# Altium project InterfaceBoard.PrjPcb
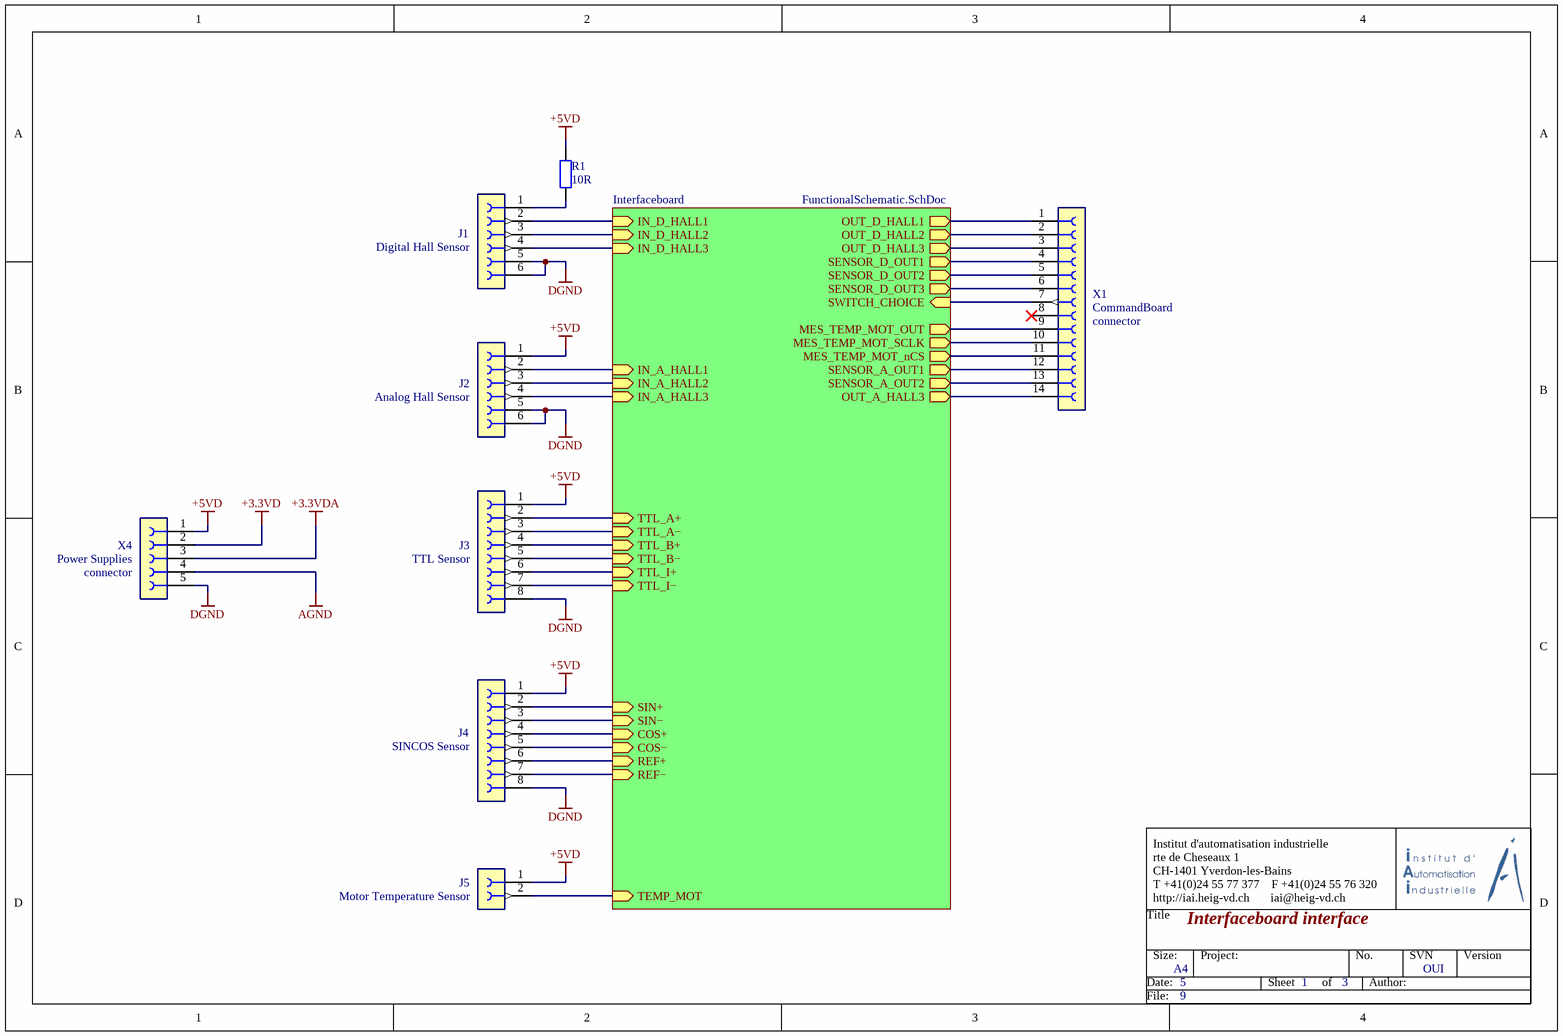
[diagram p0: InterfaceBoard.SchDoc]
ProjectAuthor: Bommottet Joan; ProjectiAiTitle: Driver Brushless; ProjectNumber: -; ProjectVersion: 1.0.0; ProjectVersionForDoc: 1_0_0
3 sheets, 74 parts. Net scope: hierarchical (ports join the sheet entries above them; power ports are global).
Board file: InterfaceBoard.PcbDoc
Sheets:
  InterfaceBoard.SchDoc
    Interfaceboard = FunctionalSchematic.SchDoc
      Differential Sinus Signal = Sensor_SINCOS.SchDoc
      Differential Cosinus Signal = Sensor_SINCOS.SchDoc

## Sheet InterfaceBoard.SchDoc: Interfaceboard interface
size A4; Author: Bommottet Joan; Organization: Institut d'Automatisation Industrielle; SheetNumber: 1; SheetTotal: 3; SVN: OUI; Version: 1.0.0; NoProject: -; ProjectTitle: Driver Brushless; CurrentTime: 6; CurrentDate: 5; DocumentFullPathAndName: 8; DocumentName: 9; ModifiedDate: 13; ProjectName: <projet>

### Parts
J1  Use: Digital Hall Sensor  [TE_7-215079-6]  (hidden comment: CONNECT SMD 6pos 180°)
J2  Use: Analog Hall Sensor  [TE_7-215079-6]  (hidden comment: CONNECT SMD 6pos 180°)
J3  Use: TTL Sensor  [TE_7-215079-8]  (hidden comment: CONNECT SMD 8pos 180°)
J4  Use: SINCOS Sensor  [TE_7-215079-8]  (hidden comment: CONNECT SMD 8pos 180°)
J5  Use: Motor Temperature Sensor  [62000611821 - 2pin]  (hidden comment: CONNECT 2pos 90°)
R1  value 10R  [RESC1508X04N]  (hidden comment: RES SMD 10R 0603)
X1  Use: CommandBoard  system: connector  [62301421021]  (hidden comment: CONNECT SMD 16pos 180°)
X4  Use: Power Supplies  system: connector  [62000611821 - 5pin]  (hidden comment: CONNECT HEADER 5pos 180°)

### Sub-sheets
Interfaceboard = FunctionalSchematic.SchDoc: IN_D_HALL1 (in), TTL_A+ (in), REF+ (in), OUT_D_HALL3 (out), SENSOR_D_OUT3 (out), SIN− (in), SENSOR_D_OUT2 (out), TTL_B− (in), OUT_D_HALL1 (out), COS+ (in), OUT_D_HALL2 (out), COS− (in), IN_D_HALL3 (in), SIN+ (in), TTL_A− (in), IN_D_HALL2 (in), TTL_B+ (in), TTL_I− (in), REF− (in), SENSOR_D_OUT1 (out), TTL_I+ (in), IN_A_HALL3 (in), OUT_A_HALL3 (out), IN_A_HALL1 (in), IN_A_HALL2 (in), TEMP_MOT (in), MES_TEMP_MOT_SCLK (out), SENSOR_A_OUT2 (out), MES_TEMP_MOT_nCS (out), MES_TEMP_MOT_OUT (out), SENSOR_A_OUT1 (out), SWITCH_CHOICE (in)

### Nets
+3.3VD: X4.2
+3.3VDA: X4.3
+5VD: J2.1 J3.1 J4.1 J5.1 R1.2 X4.1
AGND: X4.4
DGND: J1.5 J1.6 J2.5 J2.6 J3.8 J4.8 X4.5
SWITCH_CHOICE: X1.7 ; sheet Interfaceboard/SWITCH_CHOICE
NetC4_2: X1.14 ; sheet Interfaceboard/OUT_A_HALL3
NetJ1_1: J1.1 R1.1
NetJ1_2: J1.2 ; sheet Interfaceboard/IN_D_HALL1
NetJ1_3: J1.3 ; sheet Interfaceboard/IN_D_HALL2
NetJ1_4: J1.4 ; sheet Interfaceboard/IN_D_HALL3
NetJ2_2: J2.2 ; sheet Interfaceboard/IN_A_HALL1
NetJ2_3: J2.3 ; sheet Interfaceboard/IN_A_HALL2
NetJ2_4: J2.4 ; sheet Interfaceboard/IN_A_HALL3
NetJ3_2: J3.2 ; sheet Interfaceboard/TTL_A+
NetJ3_3: J3.3 ; sheet Interfaceboard/TTL_A−
NetJ3_4: J3.4 ; sheet Interfaceboard/TTL_B+
NetJ3_5: J3.5 ; sheet Interfaceboard/TTL_B−
NetJ3_6: J3.6 ; sheet Interfaceboard/TTL_I+
NetJ3_7: J3.7 ; sheet Interfaceboard/TTL_I−
NetJ4_2: J4.2 ; sheet Interfaceboard/SIN+
NetJ4_3: J4.3 ; sheet Interfaceboard/SIN−
NetJ4_4: J4.4 ; sheet Interfaceboard/COS+
NetJ4_5: J4.5 ; sheet Interfaceboard/COS−
NetJ4_6: J4.6 ; sheet Interfaceboard/REF+
NetJ4_7: J4.7 ; sheet Interfaceboard/REF−
NetJ5_2: J5.2 ; sheet Interfaceboard/TEMP_MOT
NetU1_4: X1.10 ; sheet Interfaceboard/MES_TEMP_MOT_SCLK
NetU1_5: X1.9 ; sheet Interfaceboard/MES_TEMP_MOT_OUT
NetU1_6: X1.11 ; sheet Interfaceboard/MES_TEMP_MOT_nCS
NetU2_4: X1.12 ; sheet Interfaceboard/SENSOR_A_OUT1
NetU4_2: X1.3 ; sheet Interfaceboard/OUT_D_HALL3
NetU4_5: X1.2 ; sheet Interfaceboard/OUT_D_HALL2
NetU4_7: X1.1 ; sheet Interfaceboard/OUT_D_HALL1
NetU9_4: X1.13 ; sheet Interfaceboard/SENSOR_A_OUT2
NetU10_4: X1.4 ; sheet Interfaceboard/SENSOR_D_OUT1
NetU11_4: X1.5 ; sheet Interfaceboard/SENSOR_D_OUT2
NetU12_4: X1.6 ; sheet Interfaceboard/SENSOR_D_OUT3

Not connected (* = marked no-connect by the designer): X1 8*

### Notes on the sheet
- Title
- Institut d'automatisation industrielle
  rte de Cheseaux 1
  CH-1401 Yverdon-les-Bains
  T +41(0)24 55 77 377    F +41(0)24 55 76 320
  http://iai.heig-vd.ch       iai@heig-vd.ch
- Date:
- Size:
- A4
- Project:
- Sheet
- of
- No.
- Author:
- SVN
- Version
- File:

### Library data of the parts
J1 J2 = CONNECT SMD 6pos 180° 2.54mm: Value: *
J3 J4 = CONNECT SMD 8pos 180° 2.54mm: Value: *
J5 = CONNECT 2pos 90° 3.81mm: 2 Positions, bloc de jonction Embase, broche mâle, gainée (4 côtés) 0,150 po (3,81mm) 90°, engle droit Trou traversant; Value: WR-TBL322; Supplier 1: Digi-Key; Supplier Part Number 1: 732-2088-ND
R1 = RES SMD 10 OHM 1% 1/10W 0603: 10 Ohms ±1% 0,1W, 1/10W Pavé résistif 0603 (1608 métrique) AutomobileAEC-Q200 Couche épaisse; Supplier 1: Digi-Key; Supplier Part Number 1: RMCF0603FT10R0CT-ND
X1 = CONNECT SMD 16pos 180° 2.54mm: Value: *
X4 = CONNECT HEADER 5pos 180° 2mm: Value: *

## Sheet FunctionalSchematic.SchDoc: Sensors signals conditioning
size A3; Author: Bommottet Joan; Organization: Institut d'Automatisation Industrielle; SheetNumber: 2; SheetTotal: 3; SVN: OUI; Version: 1.0.0; NoProject: -; ProjectTitle: Driver Brushless; CurrentTime: 6; CurrentDate: 5; DocumentFullPathAndName: 8; DocumentName: 9; ModifiedDate: 13; ProjectName: <projet>
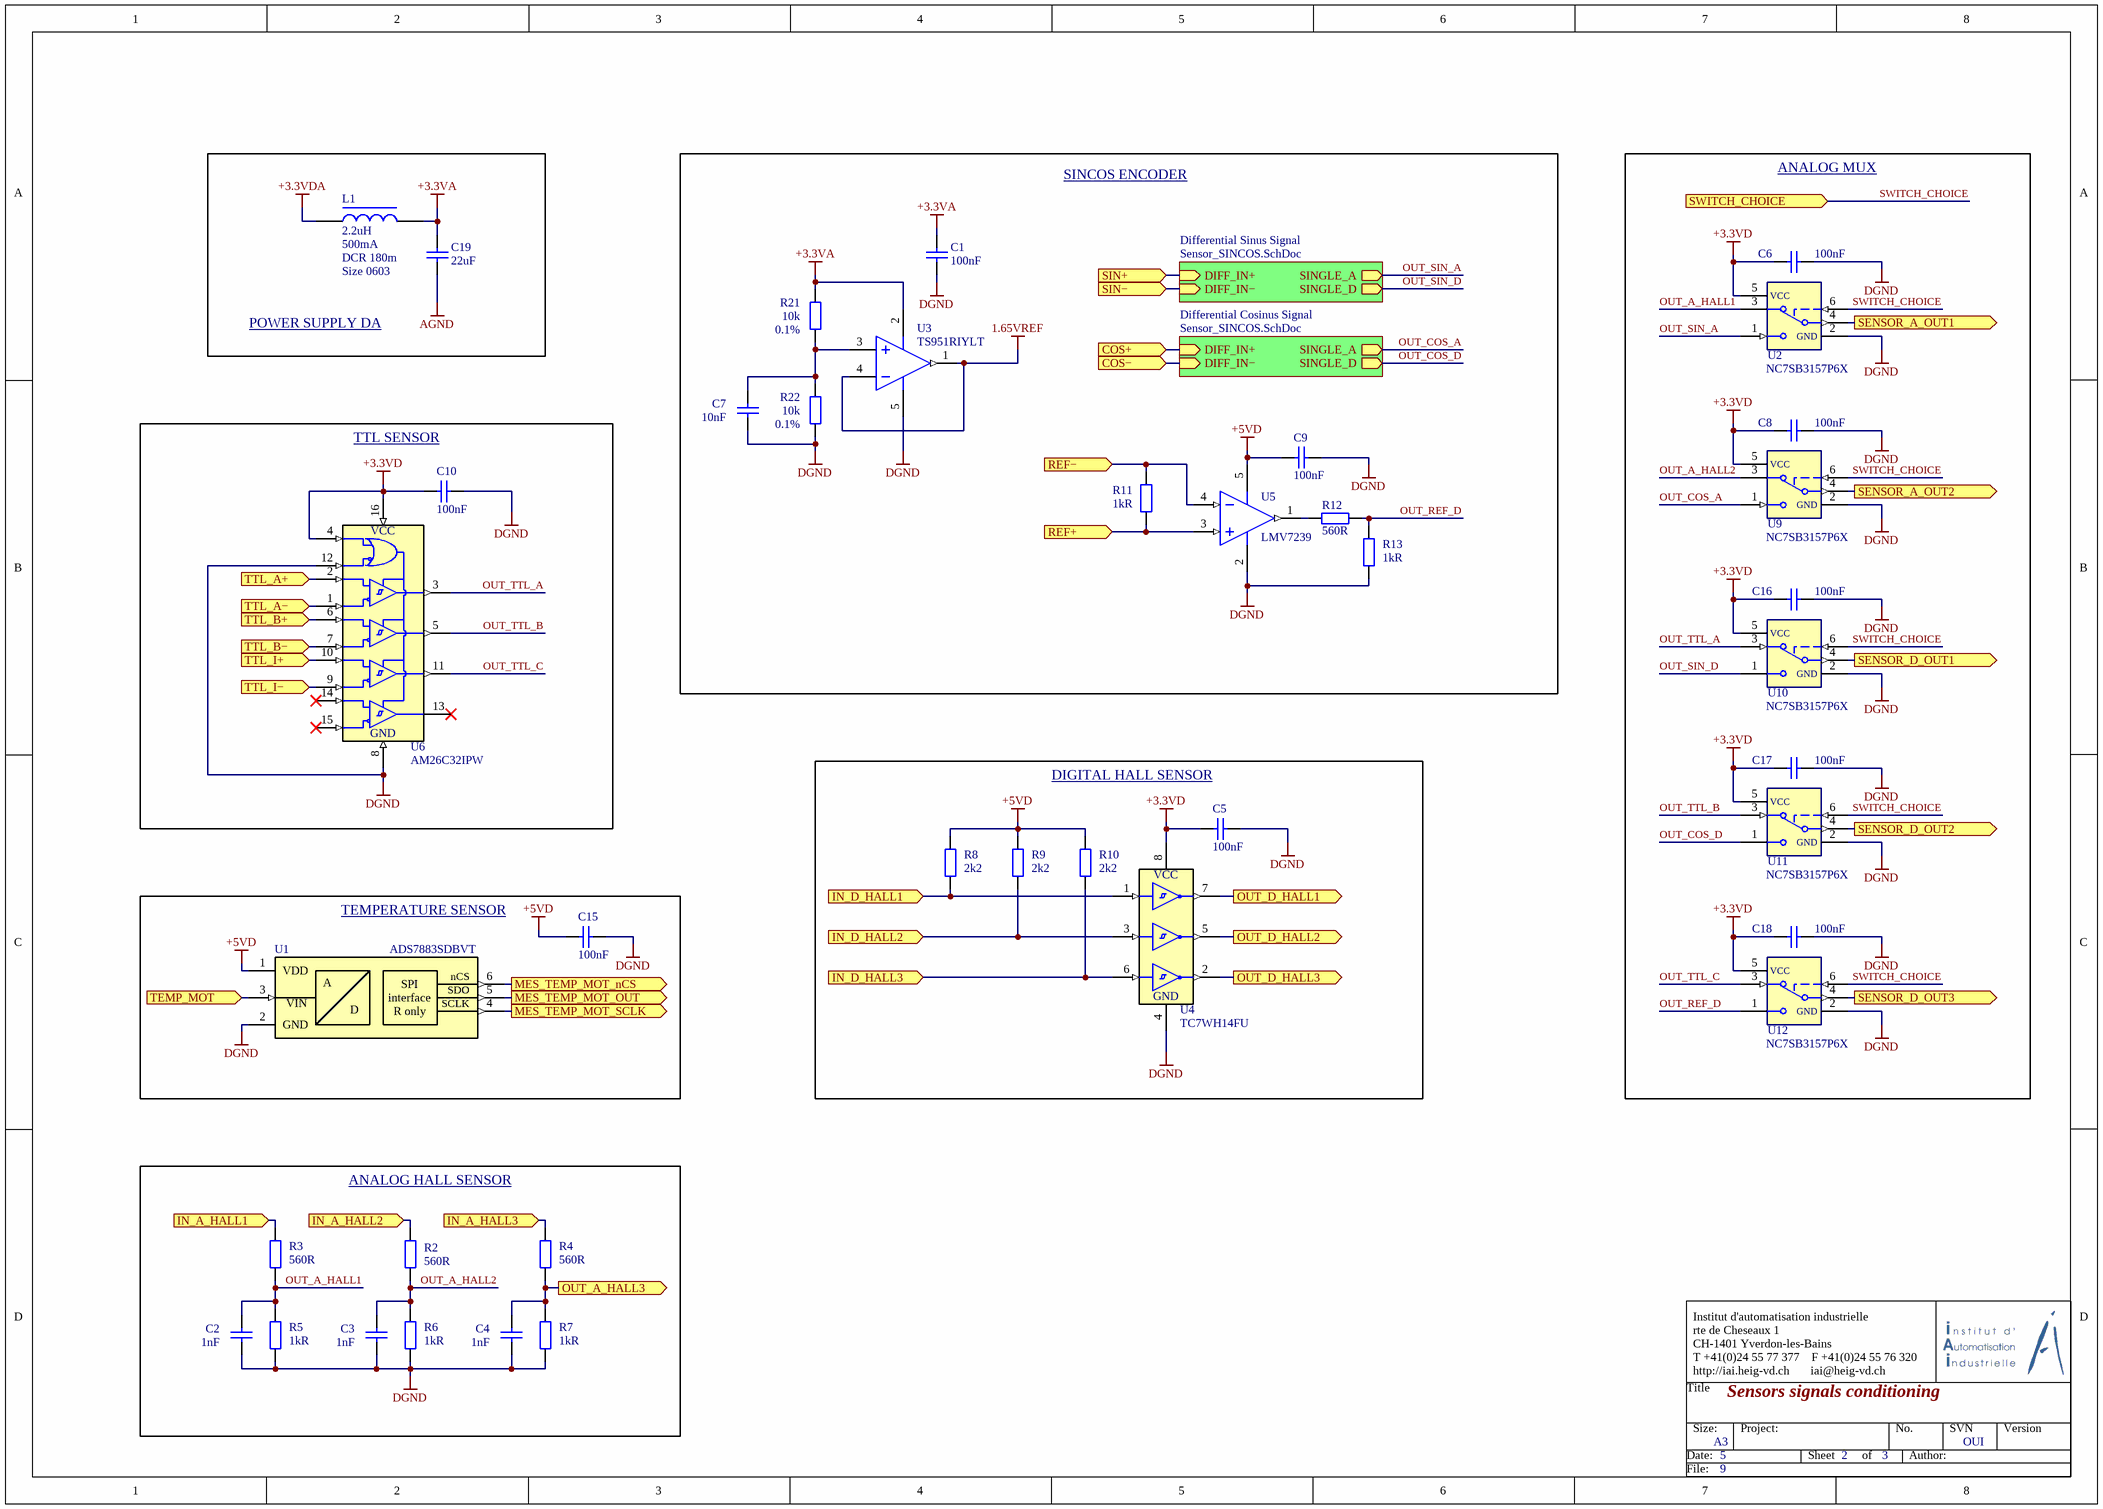
[diagram p1: FunctionalSchematic.SchDoc]

### Parts
C1  value 100nF  [CAPC1608X08N]  (hidden comment: CAP CER 0603)
C2  value 1nF  [CAPC1608X08N]  (hidden comment: CAP CER 1nF 0603)
C3  value 1nF  [CAPC1608X08N]  (hidden comment: CAP CER 1nF 0603)
C4  value 1nF  [CAPC1608X08N]  (hidden comment: CAP CER 1nF 0603)
C5  value 100nF  [CAPC1608X08N]  (hidden comment: CAP CER 100nF 0603)
C6  value 100nF  [CAPC1608X08N]  (hidden comment: CAP CER 100nF 0603)
C7  value 10nF  [CAPC1608X08N]  (hidden comment: CAP CER 0603)
C8  value 100nF  [CAPC1608X08N]  (hidden comment: CAP CER 100nF 0603)
C9  value 100nF  [CAPC1608X08N]  (hidden comment: CAP CER 100nF 0603)
C10  value 100nF  [CAPC1608X08N]  (hidden comment: CAP CER 100nF 0603)
C15  value 100nF  [CAPC1608X08N]  (hidden comment: CAP CER 100nF 0603)
C16  value 100nF  [CAPC1608X08N]  (hidden comment: CAP CER 100nF 0603)
C17  value 100nF  [CAPC1608X08N]  (hidden comment: CAP CER 100nF 0603)
C18  value 100nF  [CAPC1608X08N]  (hidden comment: CAP CER 100nF 0603)
C19  value 22uF  [CAPC1608X08N]  (hidden comment: CAP CER 22uF 0603)
L1  value 2.2uH  Current: 500mA  DCR: DCR 180m  Size: Size 0603  [INDC1608X10N]  (hidden comment: IND SMD 2.2uH 0603)
R2  value 560R  [RESC1508X04N]  (hidden comment: RES SMD 560R 0603)
R3  value 560R  [RESC1508X04N]  (hidden comment: RES SMD 560R 0603)
R4  value 560R  [RESC1508X04N]  (hidden comment: RES SMD 560R 0603)
R5  value 1kR  [RESC1508X04N]  (hidden comment: RES SMD 1K 0603)
R6  value 1kR  [RESC1508X04N]  (hidden comment: RES SMD 1K 0603)
R7  value 1kR  [RESC1508X04N]  (hidden comment: RES SMD 1K 0603)
R8  value 2k2  [RESC1508X04N]  (hidden comment: RES SMD 2K2 0603)
R9  value 2k2  [RESC1508X04N]  (hidden comment: RES SMD 2K2 0603)
R10  value 2k2  [RESC1508X04N]  (hidden comment: RES SMD 2K2 0603)
R11  value 1kR  [RESC1508X04N]  (hidden comment: RES SMD 1K 0603)
R12  value 560R  [RESC1508X04N]  (hidden comment: RES SMD 560R 0603)
R13  value 1kR  [RESC1508X04N]  (hidden comment: RES SMD 1K 0603)
R21  value 10k  Tolerance: 0.1%  [RESC1508X04N]  (hidden comment: RES SMD 0603)
R22  value 10k  Tolerance: 0.1%  [RESC1508X04N]  (hidden comment: RES SMD 0603)
U1  value ADS7883SDBVT  [SOT95P280X145-6N]  (hidden comment: IC ADC 12BIT)
U2  value NC7SB3157P6X  [SOT95P280X145-6N]  (hidden comment: Analog Switch 2:1 1ch)
U3  value TS951RIYLT  [SOT95P280X145-5N]  (hidden comment: OPAMP 1 CIRCUIT)
U4  value TC7WH14FU  [TSSOP50P310X100-8N]  (hidden comment: IC INVERTER 3CH)
U5  value LMV7239  [SOT95P280X145-5N]  (hidden comment: COMP 1 CIRCUIT)
U6  value AM26C32IPW  [TSOP65P640X120-16N]  (hidden comment: IC RECEIVER 0/4)
U9  value NC7SB3157P6X  [SOT95P280X145-6N]  (hidden comment: Analog Switch 2:1 1ch)
U10  value NC7SB3157P6X  [SOT95P280X145-6N]  (hidden comment: Analog Switch 2:1 1ch)
U11  value NC7SB3157P6X  [SOT95P280X145-6N]  (hidden comment: Analog Switch 2:1 1ch)
U12  value NC7SB3157P6X  [SOT95P280X145-6N]  (hidden comment: Analog Switch 2:1 1ch)

### Blocks framed on the sheet
POWER SUPPLY DA: C19 L1
SINCOS ENCODER: C1 C7 C9 R11-R13 R21 R22 U3 U5
ANALOG MUX: C6 C8 C16-C18 U2 U9-U12
TTL SENSOR: C10 U6
DIGITAL HALL SENSOR: C5 R8-R10 U4
TEMPERATURE SENSOR: C15 U1
ANALOG HALL SENSOR: C2-C4 R2-R7

### Sub-sheets
Differential Cosinus Signal = Sensor_SINCOS.SchDoc: DIFF_IN− (in), SINGLE_A (out), DIFF_IN+ (in), SINGLE_D (out)
Differential Sinus Signal = Sensor_SINCOS.SchDoc: DIFF_IN− (in), SINGLE_A (out), DIFF_IN+ (in), SINGLE_D (out)

### Ports
COS+ (in), COS− (in), IN_A_HALL1 (in), IN_A_HALL2 (in), IN_A_HALL3 (in), IN_D_HALL1 (in), IN_D_HALL2 (in), IN_D_HALL3 (in), MES_TEMP_MOT_nCS (out), MES_TEMP_MOT_OUT (out), MES_TEMP_MOT_SCLK (out), OUT_A_HALL3 (out), OUT_D_HALL1 (out), OUT_D_HALL2 (out), OUT_D_HALL3 (out), REF+ (in), REF− (in), SENSOR_A_OUT1 (out), SENSOR_A_OUT2 (out), SENSOR_D_OUT1 (out), SENSOR_D_OUT2 (out), SENSOR_D_OUT3 (out), SIN+ (in), SIN− (in), SWITCH_CHOICE (in), TEMP_MOT (in), TTL_A+ (in), TTL_A− (in), TTL_B+ (in), TTL_B− (in), TTL_I+ (in), TTL_I− (in)

### Nets
1.65VREF: U3.1(OUT) U3.4(IN-)
+3.3VA: C1.1 C19.2 L1.2 R21.2 U3.2(IN-)
+3.3VD: C5.2 C6.1 C8.1 C10.2 C16.1 C17.1 C18.1 U2.5(VCC) U4.8 U6.4 U6.16 U9.5(VCC) U10.5(VCC) U11.5(VCC) U12.5(VCC)
+3.3VDA: L1.1
+5VD: C9.1 C15.2 R8.2 R9.2 R10.2 U1.1(VDD) U5.5(IN-)
AGND: C19.1
DGND: C1.2 C2.1 C3.1 C4.1 C5.1 C6.2 C7.1 C8.2 C9.2 C10.1 C15.1 C16.2 C17.2 C18.2 R5.1 R6.1 R7.1 R13.1 R22.1 U1.2(GND) U2.2(GND) U3.5(IN-) U4.4 U5.2(IN-) U6.8 U6.12 U9.2(GND) U10.2(GND) U11.2(GND) U12.2(GND)
OUT_A_HALL1: C2.2 R3.1 R5.2 U2.3(S1A)
OUT_A_HALL2: C3.2 R2.1 R6.2 U9.3(S1A)
OUT_COS_A: U9.1(S2A) ; sheet Differential Cosinus Signal/SINGLE_A
OUT_COS_D: U11.1(S2A) ; sheet Differential Cosinus Signal/SINGLE_D
OUT_REF_D: R12.1 R13.2 U12.1(S2A)
OUT_SIN_A: U2.1(S2A) ; sheet Differential Sinus Signal/SINGLE_A
OUT_SIN_D: U10.1(S2A) ; sheet Differential Sinus Signal/SINGLE_D
OUT_TTL_A: U6.3 U10.3(S1A)
OUT_TTL_B: U6.5 U11.3(S1A)
OUT_TTL_C: U6.11 U12.3(S1A)
SWITCH_CHOICE: U2.6(IN1) U9.6(IN1) U10.6(IN1) U11.6(IN1) U12.6(IN1) ; port SWITCH_CHOICE
NetC4_2: C4.2 R4.1 R7.2 ; port OUT_A_HALL3
NetC7_2: C7.2 R21.1 R22.2 U3.3(IN+)
NetJ1_2: R8.1 U4.1 ; port IN_D_HALL1
NetJ1_3: R9.1 U4.3 ; port IN_D_HALL2
NetJ1_4: R10.1 U4.6 ; port IN_D_HALL3
NetJ2_2: R3.2 ; port IN_A_HALL1
NetJ2_3: R2.2 ; port IN_A_HALL2
NetJ2_4: R4.2 ; port IN_A_HALL3
NetJ3_2: U6.2 ; port TTL_A+
NetJ3_3: U6.1 ; port TTL_A−
NetJ3_4: U6.6 ; port TTL_B+
NetJ3_5: U6.7 ; port TTL_B−
NetJ3_6: U6.10 ; port TTL_I+
NetJ3_7: U6.9 ; port TTL_I−
NetJ4_2: port SIN+, sheet Differential Sinus Signal/DIFF_IN+
NetJ4_3: port SIN−, sheet Differential Sinus Signal/DIFF_IN−
NetJ4_4: port COS+, sheet Differential Cosinus Signal/DIFF_IN+
NetJ4_5: port COS−, sheet Differential Cosinus Signal/DIFF_IN−
NetJ4_6: R11.2 U5.3(IN+) ; port REF+
NetJ4_7: R11.1 U5.4(IN-) ; port REF−
NetJ5_2: U1.3(VIN) ; port TEMP_MOT
NetR12_2: R12.2 U5.1(OUT)
NetU1_4: U1.4(SCLK) ; port MES_TEMP_MOT_SCLK
NetU1_5: U1.5(nCS) ; port MES_TEMP_MOT_OUT
NetU1_6: U1.6(DOUT) ; port MES_TEMP_MOT_nCS
NetU2_4: U2.4(D1) ; port SENSOR_A_OUT1
NetU4_2: U4.2 ; port OUT_D_HALL3
NetU4_5: U4.5 ; port OUT_D_HALL2
NetU4_7: U4.7 ; port OUT_D_HALL1
NetU9_4: U9.4(D1) ; port SENSOR_A_OUT2
NetU10_4: U10.4(D1) ; port SENSOR_D_OUT1
NetU11_4: U11.4(D1) ; port SENSOR_D_OUT2
NetU12_4: U12.4(D1) ; port SENSOR_D_OUT3

Not connected (* = marked no-connect by the designer): U6 13* 14* 15*

### Notes on the sheet
- Title
- Institut d'automatisation industrielle
  rte de Cheseaux 1
  CH-1401 Yverdon-les-Bains
  T +41(0)24 55 77 377    F +41(0)24 55 76 320
  http://iai.heig-vd.ch       iai@heig-vd.ch
- Date:
- Size:
- A3
- Project:
- Sheet
- of
- No.
- Author:
- SVN
- Version
- File:
- (in symbol IC ADC 12BIT SAR SOT23-6) SPI; A; interface; SDO; R only; D
- (in symbol IC INVERTER 3CH 3-INP US8) VCC; GND
- (in symbol IC RECEIVER 0/4 16TSSOP) VCC; GND

### Library data of the parts
C1 = CAP CER 100nF 5% 10V 0603
C2-C4 = CAP CER 1nF 10% 10V 0603: 1nF ±10% 10V Condensateurs céramique X7R 0603 (1608 métrique); Supplier 1: Digi-Key; Supplier Part Number 1: 399-8984-1-ND
C5 C6 C8-C10 C15-C18 = CAP CER 100nF 10% 10V 0603: 100nF ±10% 10V Condensateurs céramique X7R 0603 (1608 métrique); Supplier 1: Digi-Key; Supplier Part Number 1: 399-1095-1-ND
C7 = CAP CER 10nF 5% 10V 0603
C19 = CAP CER 47nF 10% 10V 0603: 22µF ±20% 6,3V Condensateurs céramique X5R 0603 (1608 métrique); Supplier 1: Digi-Key; Supplier Part Number 1: 399-14498-1-ND
L1 = IND SMD 150uH 1919
R2-R4 R12 = RES SMD 560 OHM 0.1% 1/10W 0603: 560 Ohms ±1% 0,1W, 1/10W Pavé résistif 0603 (1608 métrique) AutomobileAEC-Q200 Couche épaisse; Supplier 1: Digi-Key; Supplier Part Number 1: A139816CT-ND
R5-R7 R11 R13 = RES SMD 1K OHM 1% 1/10W 0603: 1 kOhms ±1% 0,1W, 1/10W Pavé résistif 0603 (1608 métrique) AutomobileAEC-Q200 Couche épaisse; Supplier 1: Digi-Key; Supplier Part Number 1: RMCF0603FT1K00CT-ND
R8-R10 = RES SMD 2K2 OHM 1% 1/10W 0603: 2,2 kOhms ±1% 0,1W, 1/10W Pavé résistif 0603 (1608 métrique) AutomobileAEC-Q200 Couche épaisse; Supplier 1: Digi-Key; Supplier Part Number 1: RMCF0603FT2K20CT-ND
R21 R22 = RES SMD 10K OHM 0.1% 1/10W 0603: 10 kOhms ±0,1% 0,1W, 1/10W Pavé résistif 0603 (1608 métrique) AutomobileAEC-Q200 Couche mince; Supplier 1: Digi-Key; Supplier Part Number 1: P10KBDCT-ND
U1 = IC ADC 12BIT SAR SOT23-6: 12 Bits, convertisseur analogique-numérique 1 Entrée 1 SAR SOT-23-6; Supplier 1: Digi-Key; Supplier Part Number 1: 296-23635-1-ND
U2 U9-U12 = IC SWITCH SPDT: 1 Circuits, circuit intégré, commutateur 2:1 15Ohms SC-88 (SC-70-6)
U3 = IC OPAMP GP 1 CIRCUIT SOT23-5: CMOS Amplificateurs 1 Circuits Pôle à pôle SOT-23-5; Supplier 1: Digi-Key; Supplier Part Number 1: 497-15708-1-ND
U4 = IC INVERTER 3CH 3-INP US8: Inverseur IC 3 Canal US8; Supplier 1: Digi-Key; Supplier Part Number 1: TC7WH14FULJ(CTCT-ND
U5 = IC COMP PUSH-PULL 1 CIRCUIT SOT-23-5: Comparateurs Usage général Pousser-tirer, rail-à-rail SOT-23-5; Supplier 1: Digi-Key; Supplier Part Number 1: LMV7239M5/NOPBCT-ND
U6 = IC RECEIVER 0/4 16TSSOP: Récepteur 0/4 RS422, RS423 16-TSSOP; Supplier 1: Digi-Key; Supplier Part Number 1: 296-25909-5-ND

## Sheet Sensor_SINCOS.SchDoc: SINCOS sensor differential to single
size A4; Author: Bommottet Joan; Organization: Institut d'Automatisation Industrielle; SheetNumber: 3; SheetTotal: 3; SVN: OUI; Version: 1.0.0; NoProject: -; ProjectTitle: Driver Brushless; CurrentTime: 6; CurrentDate: 5; DocumentFullPathAndName: 8; DocumentName: 9; ModifiedDate: 13; ProjectName: <projet>
Used 2 times, as channels Interfaceboard/Differential Sinus Signal, Interfaceboard/Differential Cosinus Signal. Parts and nets are listed once, with the designators drawn on the sheet.
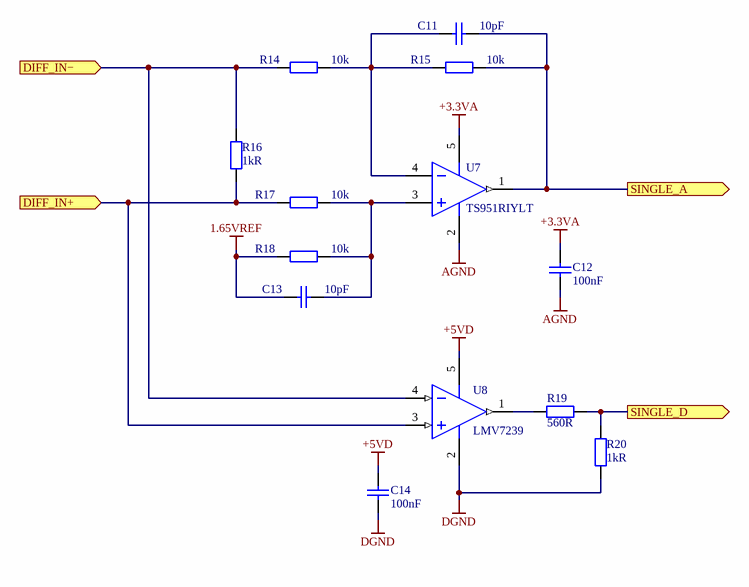
[diagram p2: Sensor_SINCOS.SchDoc]

### Parts
C11  value 10pF  [CAPC1608X08N]  (hidden comment: CAP CER 10pF 0603)
C12  value 100nF  [CAPC1608X08N]  (hidden comment: CAP CER 100nF 0603)
C13  value 10pF  [CAPC1608X08N]  (hidden comment: CAP CER 10pF 0603)
C14  value 100nF  [CAPC1608X08N]  (hidden comment: CAP CER 100nF 0603)
R14  value 10k  [RESC1508X04N]  (hidden comment: RES SMD 10K 0603)
R15  value 10k  [RESC1508X04N]  (hidden comment: RES SMD 10K 0603)
R16  value 1kR  [RESC1508X04N]  (hidden comment: RES SMD 1K 0603)
R17  value 10k  [RESC1508X04N]  (hidden comment: RES SMD 10K 0603)
R18  value 10k  [RESC1508X04N]  (hidden comment: RES SMD 10K 0603)
R19  value 560R  [RESC1508X04N]  (hidden comment: RES SMD 560R 0603)
R20  value 1kR  [RESC1508X04N]  (hidden comment: RES SMD 1K 0603)
U7  value TS951RIYLT  [SOT95P280X145-5N]  (hidden comment: OPAMP 1 CIRCUIT)
U8  value LMV7239  [SOT95P280X145-5N]  (hidden comment: COMP 1 CIRCUIT)

### Ports
DIFF_IN+ (in), DIFF_IN− (in), SINGLE_A (out), SINGLE_D (out)

### Nets
1.65VREF: C13.2 R18.2
+3.3VA: C12.2 U7.5(IN-)
+5VD: C14.2 U8.5(IN-)
AGND: C12.1 U7.2(IN-)
DGND: C14.1 R20.1 U8.2(IN-)
DIFF_IN+: R16.1 R17.1 U8.3(IN+) ; port DIFF_IN+
DIFF_IN−: R14.1 R16.2 U8.4(IN-) ; port DIFF_IN−
SINGLE_A: C11.2 R15.2 U7.1(OUT) ; port SINGLE_A
SINGLE_D: R19.1 R20.2 ; port SINGLE_D
NetC11_1: C11.1 R14.2 R15.1 U7.4(IN-)
NetC13_1: C13.1 R17.2 R18.1 U7.3(IN+)
NetR19_2: R19.2 U8.1(OUT)

### Channels
Interfaceboard/Differential Sinus Signal: designators end in _2; ports DIFF_IN+=NetJ4_2 DIFF_IN−=NetJ4_3 SINGLE_A=OUT_SIN_A SINGLE_D=OUT_SIN_D
Interfaceboard/Differential Cosinus Signal: designators end in _1; ports DIFF_IN+=NetJ4_4 DIFF_IN−=NetJ4_5 SINGLE_A=OUT_COS_A SINGLE_D=OUT_COS_D

### Notes on the sheet
- Title
- Institut d'automatisation industrielle
  rte de Cheseaux 1
  CH-1401 Yverdon-les-Bains
  T +41(0)24 55 77 377    F +41(0)24 55 76 320
  http://iai.heig-vd.ch       iai@heig-vd.ch
- Date:
- Size:
- A4
- Project:
- Sheet
- of
- No.
- Author:
- SVN
- Version
- File:

### Library data of the parts
C11 C13 = CAP CER 10pF 10% 10V 0603: 10pF ±10% 10V Condensateurs céramique X7R 0603 (1608 métrique); Supplier 1: Digi-Key; Supplier Part Number 1: 399-17563-1-ND
C12 C14 = CAP CER 100nF 10% 10V 0603: as C5 on sheet FunctionalSchematic; Supplier 1: Digi-Key; Supplier Part Number 1: 399-1095-1-ND
R14 R15 R17 R18 = RES SMD 10K OHM 1% 1/10W 0603: 10 kOhms ±1% 0,1W, 1/10W Pavé résistif 0603 (1608 métrique) AutomobileAEC-Q200 Couche épaisse; Supplier 1: Digi-Key; Supplier Part Number 1: RMCF0603FT10K0CT-ND
R16 R20 = RES SMD 1K OHM 1% 1/10W 0603: as R5 on sheet FunctionalSchematic; Supplier 1: Digi-Key; Supplier Part Number 1: RMCF0603FT1K00CT-ND
R19 = RES SMD 560 OHM 0.1% 1/10W 0603: as R2 on sheet FunctionalSchematic; Supplier 1: Digi-Key; Supplier Part Number 1: A139816CT-ND
U7 = IC OPAMP GP 1 CIRCUIT SOT23-5: as U3 on sheet FunctionalSchematic; Supplier 1: Digi-Key; Supplier Part Number 1: 497-15708-1-ND
U8 = IC COMP PUSH-PULL 1 CIRCUIT SOT-23-5: as U5 on sheet FunctionalSchematic; Supplier 1: Digi-Key; Supplier Part Number 1: LMV7239M5/NOPBCT-ND

## Nets that join several sheets
1.65VREF: FunctionalSchematic (U3.1 U3.4), Interfaceboard/Differential Sinus Signal (C13_2.2 R18_2.2), Interfaceboard/Differential Cosinus Signal (C13_1.2 R18_1.2)
+3.3VA: FunctionalSchematic (5 pins), Interfaceboard/Differential Sinus Signal (C12_2.2 U7_2.5), Interfaceboard/Differential Cosinus Signal (C12_1.2 U7_1.5)
+3.3VD: InterfaceBoard (X4.2), FunctionalSchematic (15 pins)
+3.3VDA: InterfaceBoard (X4.3), FunctionalSchematic (L1.1)
+5VD: InterfaceBoard (6 pins), FunctionalSchematic (7 pins), Interfaceboard/Differential Sinus Signal (C14_2.2 U8_2.5), Interfaceboard/Differential Cosinus Signal (C14_1.2 U8_1.5)
AGND: InterfaceBoard (X4.4), FunctionalSchematic (C19.1), Interfaceboard/Differential Sinus Signal (C12_2.1 U7_2.2), Interfaceboard/Differential Cosinus Signal (C12_1.1 U7_1.2)
DGND: InterfaceBoard (7 pins), FunctionalSchematic (30 pins), Interfaceboard/Differential Sinus Signal (C14_2.1 R20_2.1 U8_2.2), Interfaceboard/Differential Cosinus Signal (C14_1.1 R20_1.1 U8_1.2)
NetC4_2: InterfaceBoard (X1.14), FunctionalSchematic (C4.2 R4.1 R7.2)
NetJ1_2: InterfaceBoard (J1.2), FunctionalSchematic (R8.1 U4.1)
NetJ1_3: InterfaceBoard (J1.3), FunctionalSchematic (R9.1 U4.3)
NetJ1_4: InterfaceBoard (J1.4), FunctionalSchematic (R10.1 U4.6)
NetJ2_2: InterfaceBoard (J2.2), FunctionalSchematic (R3.2)
NetJ2_3: InterfaceBoard (J2.3), FunctionalSchematic (R2.2)
NetJ2_4: InterfaceBoard (J2.4), FunctionalSchematic (R4.2)
NetJ3_2: InterfaceBoard (J3.2), FunctionalSchematic (U6.2)
NetJ3_3: InterfaceBoard (J3.3), FunctionalSchematic (U6.1)
NetJ3_4: InterfaceBoard (J3.4), FunctionalSchematic (U6.6)
NetJ3_5: InterfaceBoard (J3.5), FunctionalSchematic (U6.7)
NetJ3_6: InterfaceBoard (J3.6), FunctionalSchematic (U6.10)
NetJ3_7: InterfaceBoard (J3.7), FunctionalSchematic (U6.9)
NetJ4_2: InterfaceBoard (J4.2), Interfaceboard/Differential Sinus Signal (R16_2.1 R17_2.1 U8_2.3)
NetJ4_3: InterfaceBoard (J4.3), Interfaceboard/Differential Sinus Signal (R14_2.1 R16_2.2 U8_2.4)
NetJ4_4: InterfaceBoard (J4.4), Interfaceboard/Differential Cosinus Signal (R16_1.1 R17_1.1 U8_1.3)
NetJ4_5: InterfaceBoard (J4.5), Interfaceboard/Differential Cosinus Signal (R14_1.1 R16_1.2 U8_1.4)
NetJ4_6: InterfaceBoard (J4.6), FunctionalSchematic (R11.2 U5.3)
NetJ4_7: InterfaceBoard (J4.7), FunctionalSchematic (R11.1 U5.4)
NetJ5_2: InterfaceBoard (J5.2), FunctionalSchematic (U1.3)
NetU1_4: InterfaceBoard (X1.10), FunctionalSchematic (U1.4)
NetU1_5: InterfaceBoard (X1.9), FunctionalSchematic (U1.5)
NetU1_6: InterfaceBoard (X1.11), FunctionalSchematic (U1.6)
NetU2_4: InterfaceBoard (X1.12), FunctionalSchematic (U2.4)
NetU4_2: InterfaceBoard (X1.3), FunctionalSchematic (U4.2)
NetU4_5: InterfaceBoard (X1.2), FunctionalSchematic (U4.5)
NetU4_7: InterfaceBoard (X1.1), FunctionalSchematic (U4.7)
NetU9_4: InterfaceBoard (X1.13), FunctionalSchematic (U9.4)
NetU10_4: InterfaceBoard (X1.4), FunctionalSchematic (U10.4)
NetU11_4: InterfaceBoard (X1.5), FunctionalSchematic (U11.4)
NetU12_4: InterfaceBoard (X1.6), FunctionalSchematic (U12.4)
OUT_COS_A: FunctionalSchematic (U9.1), Interfaceboard/Differential Cosinus Signal (C11_1.2 R15_1.2 U7_1.1)
OUT_COS_D: FunctionalSchematic (U11.1), Interfaceboard/Differential Cosinus Signal (R19_1.1 R20_1.2)
OUT_SIN_A: FunctionalSchematic (U2.1), Interfaceboard/Differential Sinus Signal (C11_2.2 R15_2.2 U7_2.1)
OUT_SIN_D: FunctionalSchematic (U10.1), Interfaceboard/Differential Sinus Signal (R19_2.1 R20_2.2)
SWITCH_CHOICE: InterfaceBoard (X1.7), FunctionalSchematic (5 pins)